# Altium schematic sheet schematic.SchDoc
size A4; SheetNumber: 1; SheetTotal: 1
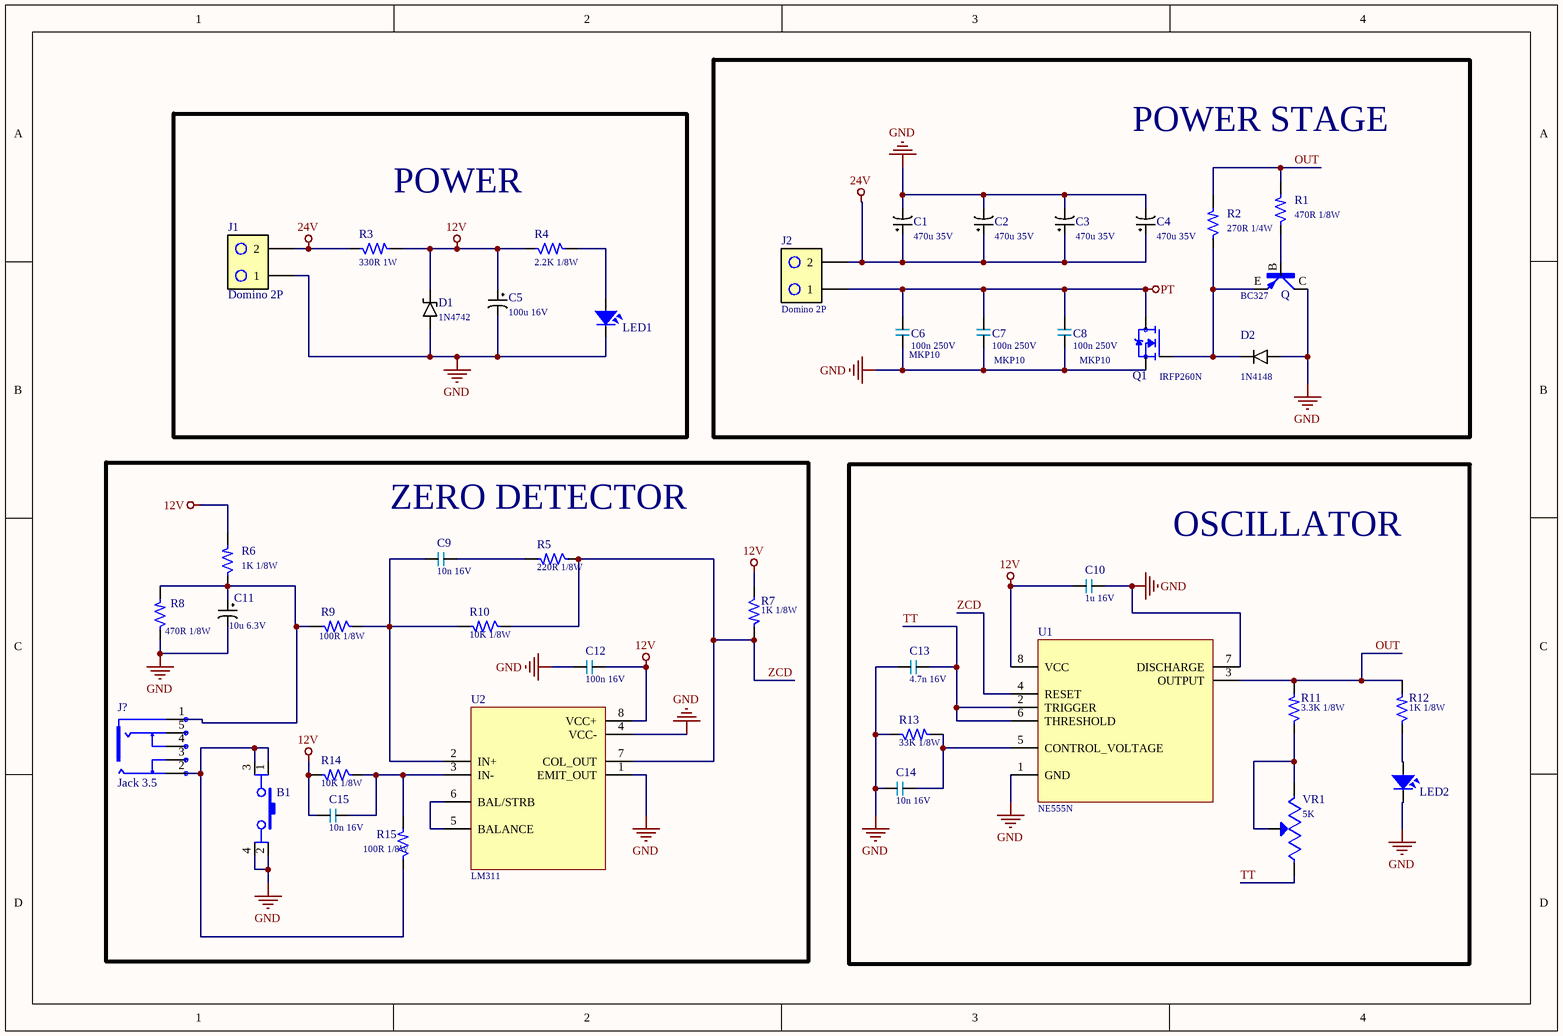
[diagram p0: schematic.SchDoc]

## Parts
B1  Button  [Button 4 DIP]  (value not drawn)
C1  470u 35V  [CAP_10X16]
C2  470u 35V  [CAP_10X16]
C3  470u 35V  [CAP_10X16]
C4  470u 35V  [CAP_10X16]
C5  100u 16V  [CAP 5x11]
C6  MKP10: 100n 250V  [MKP10]
C7  MKP10: 100n 250V  [MKP10]
C8  MKP10: 100n 250V  [MKP10]
C9  10n 16V  [CAP_2.54mm]
C10  1u 16V  [CAP_2.54mm]
C11  10u 6.3V  [CAP 5x11]
C12  100n 16V  [CAP_2.54mm]
C13  4.7n 16V  [CAP_2.54mm]
C14  10n 16V  [CAP_2.54mm]
C15  10n 16V  [CAP_2.54mm]
D1  1N4742  [DIOAD1060W70L435D230]
D2  1N4148  [1N4148]
J1  Domino 2P  [HANDSON_KF301-2P]
J2  Domino 2P  [HANDSON_KF301-2P]
J?  Jack 3.5  [PJ-307]
LED1  LED  [LED-5-RED]  (value not drawn)
LED2  LED  [LED-5-RED]  (value not drawn)
Q  BC327  [TO-92]
Q1  IRFP260N  [IRFP260N]
R1  470R 1/8W  [R1/8W]
R2  270R 1/4W  [R1/8W]
R3  330R 1W  [R1/2W]
R4  2.2K 1/8W  [R1/8W]
R5  220R 1/8W  [R1/8W]
R6  1K 1/8W  [R1/8W]
R7  1K 1/8W  [R1/8W]
R8  470R 1/8W  [R1/8W]
R9  100R 1/8W  [R1/8W]
R10  10K 1/8W  [R1/8W]
R11  3.3K 1/8W  [R1/8W]
R12  1K 1/8W  [R1/8W]
R13  33K 1/8W  [R1/8W]
R14  10K 1/8W  [R1/8W]
R15  100R 1/8W  [R1/8W]
U1  NE555N  [NE555PE]
U2  LM311  [LM311PE]
VR1  5K  [TRIM_3296W-1-502]

## Blocks framed on the sheet
POWER STAGE: C1-C4 C6-C8 D2 J2 Q Q1 R1 R2
POWER: C5 D1 J1 LED1 R3 R4
ZERO DETECTOR: B1 C9 C11 C12 C15 J? R5-R10 R14 R15 U2
OSCILLATOR: C10 C13 C14 LED2 R11-R13 U1 VR1

## Nets
12V: C5.1 C10.1 C12.2 C15.1 D1.K R3.2 R4.1 R6.2 R7.1 R14.2 U1.8(VCC) U2.8(VCC+)
24V: C1.1 C2.1 C3.1 C4.1 J1.2 J2.2 R3.1
GND: B1.2 B1.4 C1.2 C2.2 C3.2 C4.2 C5.2 C6.1 C7.1 C8.1 C10.2 C11.2 C12.1 C13.1 C14.1 D1.A D2.A J1.1 LED1.2 LED2.2 Q.C Q1.3(S) R8.1 R13.1 U1.1(GND) U1.7(DISCHARGE) U2.1(EMIT_OUT) U2.4(VCC-)
PT: C6.2 C7.2 C8.2 J2.1 Q1.2(D)
OUT: R1.2 R2.2 R11.2 R12.2 U1.3(OUTPUT)
TT: C13.2 U1.2(TRIGGER) U1.6(THRESHOLD) VR1.1(CCW)
ZCD: R5.1 R7.2 R10.1 U1.4(RESET) U2.7(COL_OUT)
NetB1_1: B1.1 B1.3 J?.2 R15.1
NetC9_1: C9.1 R9.1 R10.2 U2.2(IN+)
NetC9_2: C9.2 R5.2
NetC11_1: C11.1 J?.1 R6.1 R8.2 R9.2
NetC14_2: C14.2 R13.2 U1.5(CONTROL_VOLTAGE)
NetC15_2: C15.2 R14.1 R15.2 U2.3(IN-)
NetD2_K: D2.K Q.E Q1.1(G) R2.1
NetLED1_1: LED1.1 R4.2
NetLED2_1: LED2.1 R12.1
NetQ_B: Q.B R1.1
NetR11_1: R11.1 VR1.2(WIPER) VR1.3(CW)
NetU2_5: U2.5(BALANCE) U2.6(BAL/STRB)

Not connected (* = marked no-connect by the designer): J? 3 4 5

## Notes on the sheet
- (near C6) MKP10
- (near C7) MKP10
- MKP10

## Library data of the parts
B1 = Button DIP
C1-C5 C11 = Cap_P: Value: 100uF
C6-C10 C12-C15 = CAP
  C9 C14 C15: Value: 10n 16V
  C10: Value: 1u 16V
  C12: Value: 100n 16V
  C13: Value: 4.7n 16V
D1 = DIODE Z
D2 = DIODE
J1 J2 = Domino 2P: 2 Pin Terminal Block 5mm Pitch. KF301-2P; Price: None; Value: *; MP: KF301-2P; Package: None; Availability: Unavailable
J? = Jack 3.5 mr
LED1 LED2 = LED: LED Single colour Green and Red; Value: LED 3 ly Single Colour
Q = Transistor: Transistor bipolar _BJT_ PNP 45V 800mA 100MHz 625mW Agujero pasante TO-92-3; MF: ON; MP: BC327BU; Value: *; Price: None; Package: TO-92 Fairchild Semiconductor; SnapEDA_Link: https://www.snapeda.com/parts/BC327BU/ON%20Semiconductor/view-part/829010/?ref=snap; Availability: Unavailable
Q1 = IRFP260N: N-Channel 200V 50A (Tc) 300W (Tc) Through Hole TO-247AC; MF: Infineon Technologies; Check_prices: https://www.snapeda.com/parts/IRFP260N/Infineon%20Technologies/view-part/2777552/?ref=eda; SnapEDA_Link: https://www.snapeda.com/parts/IRFP260N/Infineon%20Technologies/view-part/2777552/?ref=snap; MP: IRFP260N; Availability: Unavailable; Value: *; Price: None; Package: TO-247-3 Infineon Technologies
R1-R15 = Res
U1 = NE555N: 555 Type, Timer/Oscillator (Single) IC 500kHz 8-DIP; MF: STMicroelectronics; SnapEDA_Link: https://www.snapeda.com/parts/NE555N/STMicroelectronics/view-part/?ref=snap; MP: NE555N; Availability: In Stock; Price: None; Value: *; Check_prices: https://www.snapeda.com/parts/NE555N/STMicroelectronics/view-part/?ref=eda; Package: DIP-8 STMicroelectronics; Purchase-URL: https://pricing.snapeda.com/search/part/NE555N/?ref=eda
U2 = LM311: High Speed, 30V, Differential Comparator With Strobes 8-PDIP 0 to 70; MF: Texas Instruments; MP: LM311PE4; Availability: In Stock; SnapEDA_Link: https://www.snapeda.com/parts/LM311PE4/Texas+Instruments/view-part/?ref=snap; Check_prices: https://www.snapeda.com/parts/LM311PE4/Texas+Instruments/view-part/?ref=eda; Price: None; Package: PDIP-8 Texas; Purchase-URL: https://pricing.snapeda.com/search/part/LM311PE4/?ref=eda; Value: *
VR1 = Res var: 5 kOhms 0.5W, 1/2W PC Pins Through Hole Trimmer Potentiometer Cermet 25.0 Turn Top Adjustment; MF: Bourns; MP: 3296W-1-502; Package: SOT-23-5 Bourns; SnapEDA_Link: https://www.snapeda.com/parts/3296W-1-502/Bourns/view-part/?ref=snap; Purchase-URL: https://pricing.snapeda.com/search/part/3296W-1-502/?ref=eda; Check_prices: https://www.snapeda.com/parts/3296W-1-502/Bourns/view-part/?ref=eda; Price: None; Availability: In Stock; Value: *